# EAGLE design GolGrid (EAGLE 5.11)
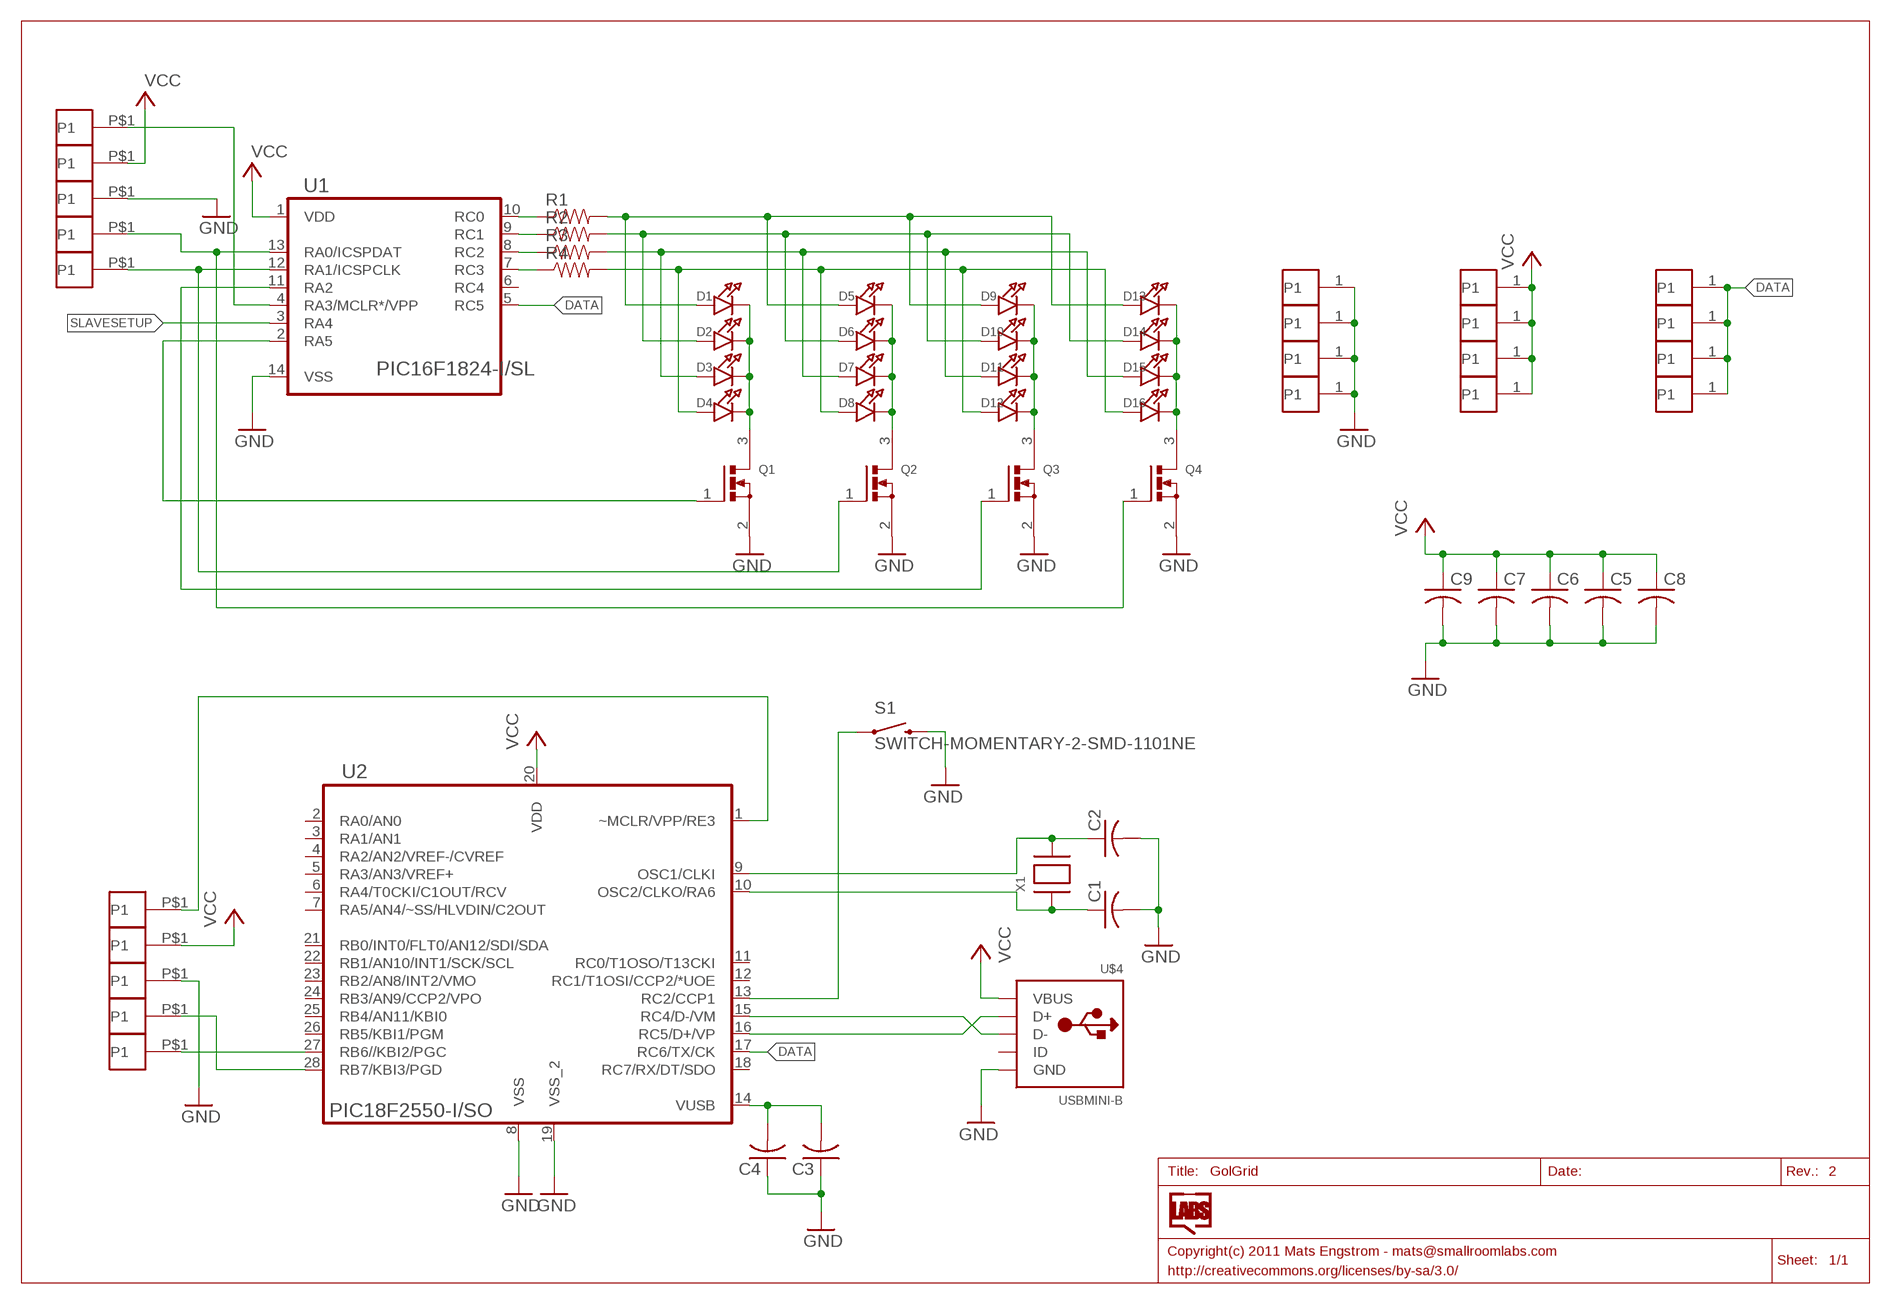
[diagram p0: schematic, sheet 1]

## Parts
C1  C-USC0805  [C0805]
C2  C-USC0805  [C0805]
C3  C-USC0805  [C0805]
C4  C-USC0805  [C0805]
C5  C-USC1206  [C1206]
C6  C-USC0805  [C0805]
C7  C-USC0805  [C0805]
C8  C-USC1206  [C1206]
C9  C-USC1206  [C1206]
D1  LEDSMD0805  [CHIPLED_0805]
D2  LEDSMD0805  [CHIPLED_0805]
D3  LEDSMD0805  [CHIPLED_0805]
D4  LEDSMD0805  [CHIPLED_0805]
D5  LEDSMD0805  [CHIPLED_0805]
D6  LEDSMD0805  [CHIPLED_0805]
D7  LEDSMD0805  [CHIPLED_0805]
D8  LEDSMD0805  [CHIPLED_0805]
D9  LEDSMD0805  [CHIPLED_0805]
D10  LEDSMD0805  [CHIPLED_0805]
D11  LEDSMD0805  [CHIPLED_0805]
D12  LEDSMD0805  [CHIPLED_0805]
D13  LEDSMD0805  [CHIPLED_0805]
D14  LEDSMD0805  [CHIPLED_0805]
D15  LEDSMD0805  [CHIPLED_0805]
D16  LEDSMD0805  [CHIPLED_0805]
P1  PAD06S1  [PAD06STOP1]
P2  PAD06S1  [PAD06STOP1]
P3  PAD06S1  [PAD06STOP1]
P4  PAD06S1  [PAD06STOP1]
P5  PAD06S1  [PAD06STOP1]
P6  PAD06S1  [PAD06STOP1]
P7  PAD06S1  [PAD06STOP1]
P8  PAD06S1  [PAD06STOP1]
P9  PAD06S1  [PAD06STOP1]
P10  PAD06S1  [PAD06STOP1]
P11  PAD06S1  [PAD06STOP1]
P12  PAD06S1  [PAD06STOP1]
PGND1  PADPAD1.5X2.5  [PAD1.5X2.5]
PGND2  PADPAD1.5X2.5  [PAD1.5X2.5]
PPGC1  PADPAD1.5X2.5  [PAD1.5X2.5]
PPGC2  PADPAD1.5X2.5  [PAD1.5X2.5]
PPGD1  PADPAD1.5X2.5  [PAD1.5X2.5]
PPGD2  PADPAD1.5X2.5  [PAD1.5X2.5]
PVCC1  PADPAD1.5X2.5  [PAD1.5X2.5]
PVCC2  PADPAD1.5X2.5  [PAD1.5X2.5]
PVPP1  PADPAD1.5X2.5  [PAD1.5X2.5]
PVPP2  PADPAD1.5X2.5  [PAD1.5X2.5]
Q1  MOSFET-NWAVE  [SOT23-W]
Q2  MOSFET-NWAVE  [SOT23-W]
Q3  MOSFET-NWAVE  [SOT23-W]
Q4  MOSFET-NWAVE  [SOT23-W]
R1  RESISTOR0805-RES  [0805]
R2  RESISTOR0805-RES  [0805]
R3  RESISTOR0805-RES  [0805]
R4  RESISTOR0805-RES  [0805]
S1  SWITCH-MOMENTARY-2-SMD-1101NE  [TACTILE-SWITCH-1101NE]
U1  PIC16F1824-I/SL  [SOIC127P600X175-14N]
U2  PIC18F2550-I/SO  [SOIC127P1034X264-28N]
U$4  USBMINI-B  [MOLEX67503]
X1  XTALNX5032  [NX5032]

## Nets
ANODE1: D1.A D5.A D9.A D13.A R1.2
ANODE2: D2.A D6.A D10.A D14.A R2.2
ANODE3: D3.A D7.A D11.A D15.A R3.2
ANODE4: D4.A D8.A D12.A D16.A R4.2
CATH0: PPGD1.P$1(P1) Q4.1(G) U1.13(RA0/ICSPDAT)
CATH1: PPGC1.P$1(P1) Q2.1(G) U1.12(RA1/ICSPCLK)
CATH2: Q3.1(G) U1.11(RA2)
CATH3: Q1.1(G) U1.2(RA5)
CATHODE1: D1.C D2.C D3.C D4.C Q1.3(D)
CATHODE2: D5.C D6.C D7.C D8.C Q2.3(D)
CATHODE3: D9.C D10.C D11.C D12.C Q3.3(D)
CATHODE4: D13.C D14.C D15.C D16.C Q4.3(D)
DATA: P9.1 P10.1 P11.1 P12.1 U1.5(RC5) U2.17(RC6/TX/CK)
GND: C1.2 C2.2 C3.1 C4.1 C5.2 C6.2 C7.2 C8.2 C9.2 P1.1 P2.1 P3.1 P4.1 PGND1.P$1(P1) PGND2.P$1(P1) Q1.2(S) Q2.2(S) Q3.2(S) Q4.2(S) S1.P$2 U1.14(VSS) U2.8(VSS) U2.19(VSS_2) U$4.GND
N$1: R1.1 U1.10(RC0)
N$2: C3.2 C4.2 U2.14(VUSB)
N$3: R2.1 U1.9(RC1)
N$4: R3.1 U1.8(RC2)
N$5: R4.1 U1.7(RC3)
N$6: C1.1 U2.10(OSC2/CLKO/RA6) X1.P$1
N$7: C2.1 U2.9(OSC1/CLKI) X1.P$2
N$8: U2.16(RC5/D+/VP) U$4.D+
N$9: U2.15(RC4/D-/VM) U$4.D-
N$10: PPGD2.P$1(P1) U2.28(RB7/KBI3/PGD)
N$11: PPGC2.P$1(P1) U2.27(RB6//KBI2/PGC)
N$12: PVPP2.P$1(P1) U2.1(~MCLR/VPP/RE3)
N$14: S1.P$1 U2.13(RC2/CCP1)
N$15: PVPP1.P$1(P1) U1.4(RA3/MCLR*/VPP)
SLAVESETUP: U1.3(RA4)
VCC: C5.1 C6.1 C7.1 C8.1 C9.1 P5.1 P6.1 P7.1 P8.1 PVCC1.P$1(P1) PVCC2.P$1(P1) U1.1(VDD) U2.20(VDD) U$4.VBUS
Unconnected: U1.6(RC4) U2.2(RA0/AN0) U2.3(RA1/AN1) U2.4(RA2/AN2/VREF-/CVREF) U2.5(RA3/AN3/VREF+) U2.6(RA4/T0CKI/C1OUT/RCV) U2.7(RA5/AN4/~SS/HLVDIN/C2OUT) U2.11(RC0/T1OSO/T13CKI) U2.12(RC1/T1OSI/CCP2/*UOE) U2.18(RC7/RX/DT/SDO) U2.21(RB0/INT0/FLT0/AN12/SDI/SDA) U2.22(RB1/AN10/INT1/SCK/SCL) U2.23(RB2/AN8/INT2/VMO) U2.24(RB3/AN9/CCP2/VPO) U2.25(RB4/AN11/KBI0) U2.26(RB5/KBI1/PGM) U$4.ID

## Library data of the parts
C1-C9 = rcl:C-US: CAPACITOR, American symbol
D1-D16 = SmallRoomLabs:LED
P1-P12 PGND1 PGND2 PPGC1 PPGC2 PPGD1 PPGD2 PVCC1 PVCC2 PVPP1 PVPP2 = SmallRoomLabs:PAD
Q1-Q4 = microbuilder:MOSFET-N: N-Channel Mosfet Digikey: 2N7002ET1GOSTR-ND
R1-R4 = SparkFun:RESISTOR: Resistor Basic schematic elements and footprints for 0603, 1206, and PTH resistors.
S1 = SparkFun:SWITCH-MOMENTARY-2
U1 = SmallRoomLabs:PIC16F1824-I/SL: 14/20-Pin Flash Microcontrollers with XLP Technology,SOIC-14; MPN: PIC16F1824-I/SL; OC_FARNELL: 1814945; OC_NEWARK: 65R5965; PACKAGE: SOIC-14; SUPPLIER: Microchip
U2 = SmallRoomLabs:PIC18F2550-I/SO: High-Performance Enhanced Flash Microcontrollers; MPN: PIC18F2550-I/SO; OC_FARNELL: 9321268; OC_NEWARK: 73K1297; PACKAGE: SOIC-28; SUPPLIER: Microchip
U$4 = SmallRoomLabs:USB
X1 = adafruit:XTAL: Low cost SMT crystals, no capacitors included http://www.ladyada.net/library/eagle

## Board
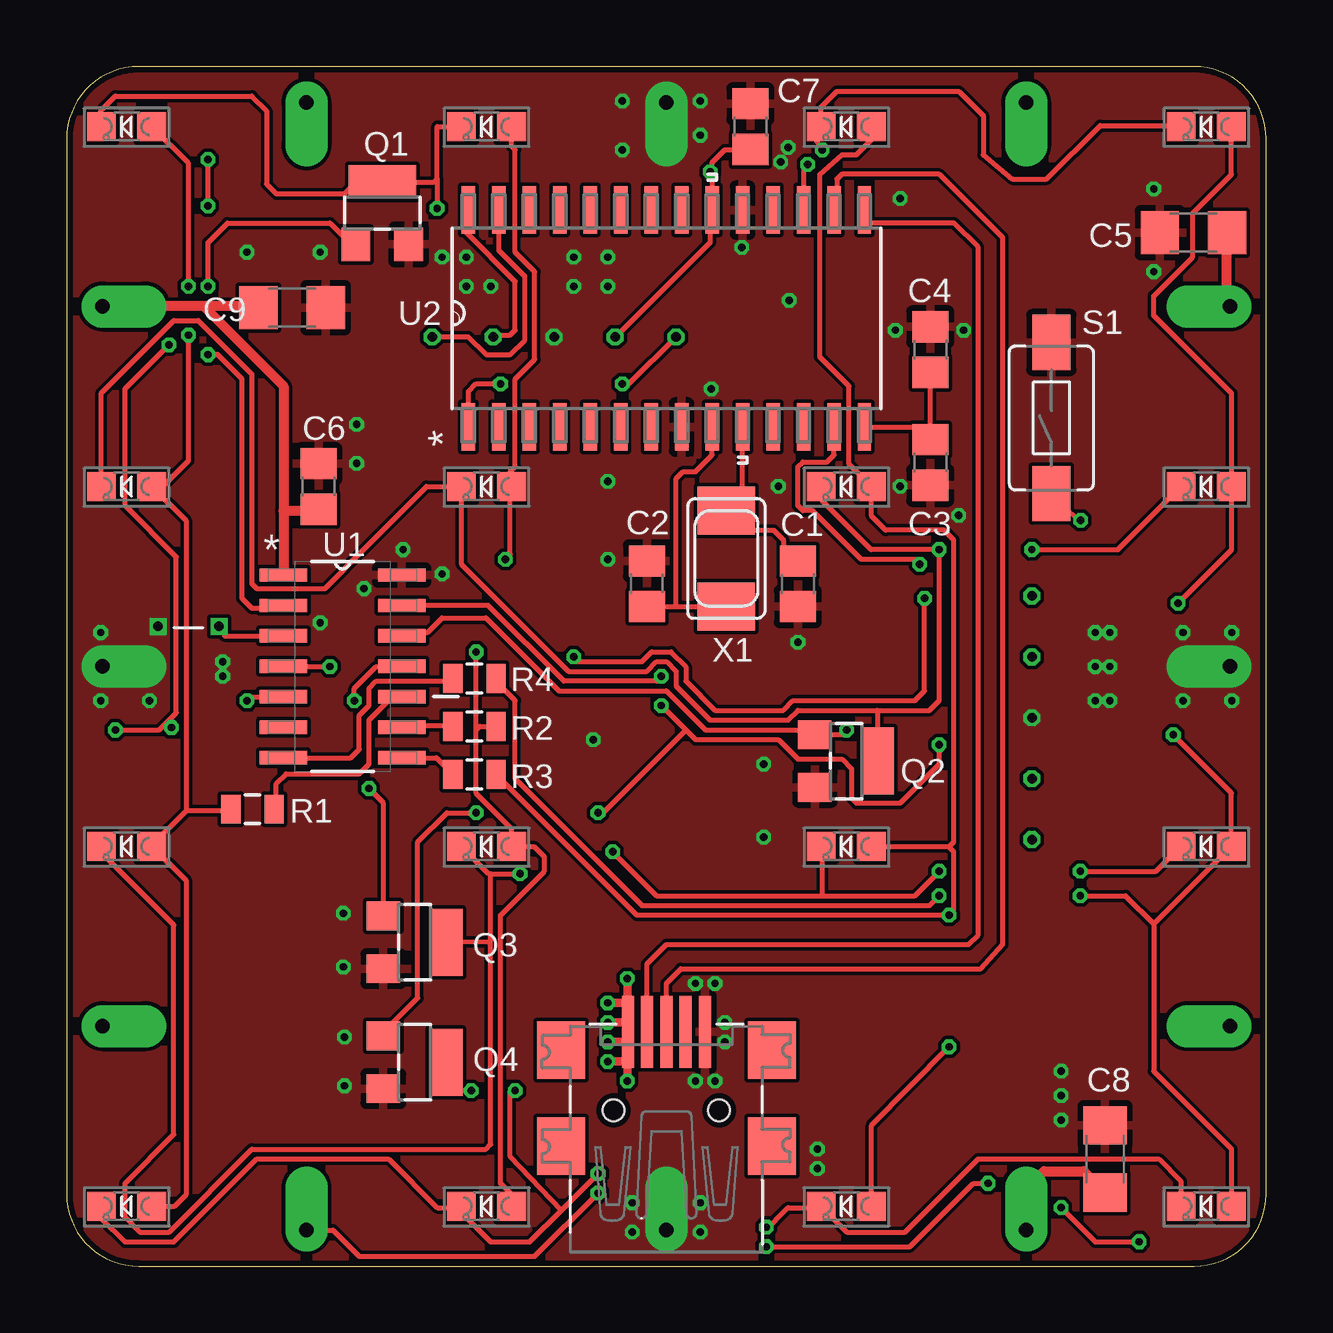
[diagram p1: board, top side]
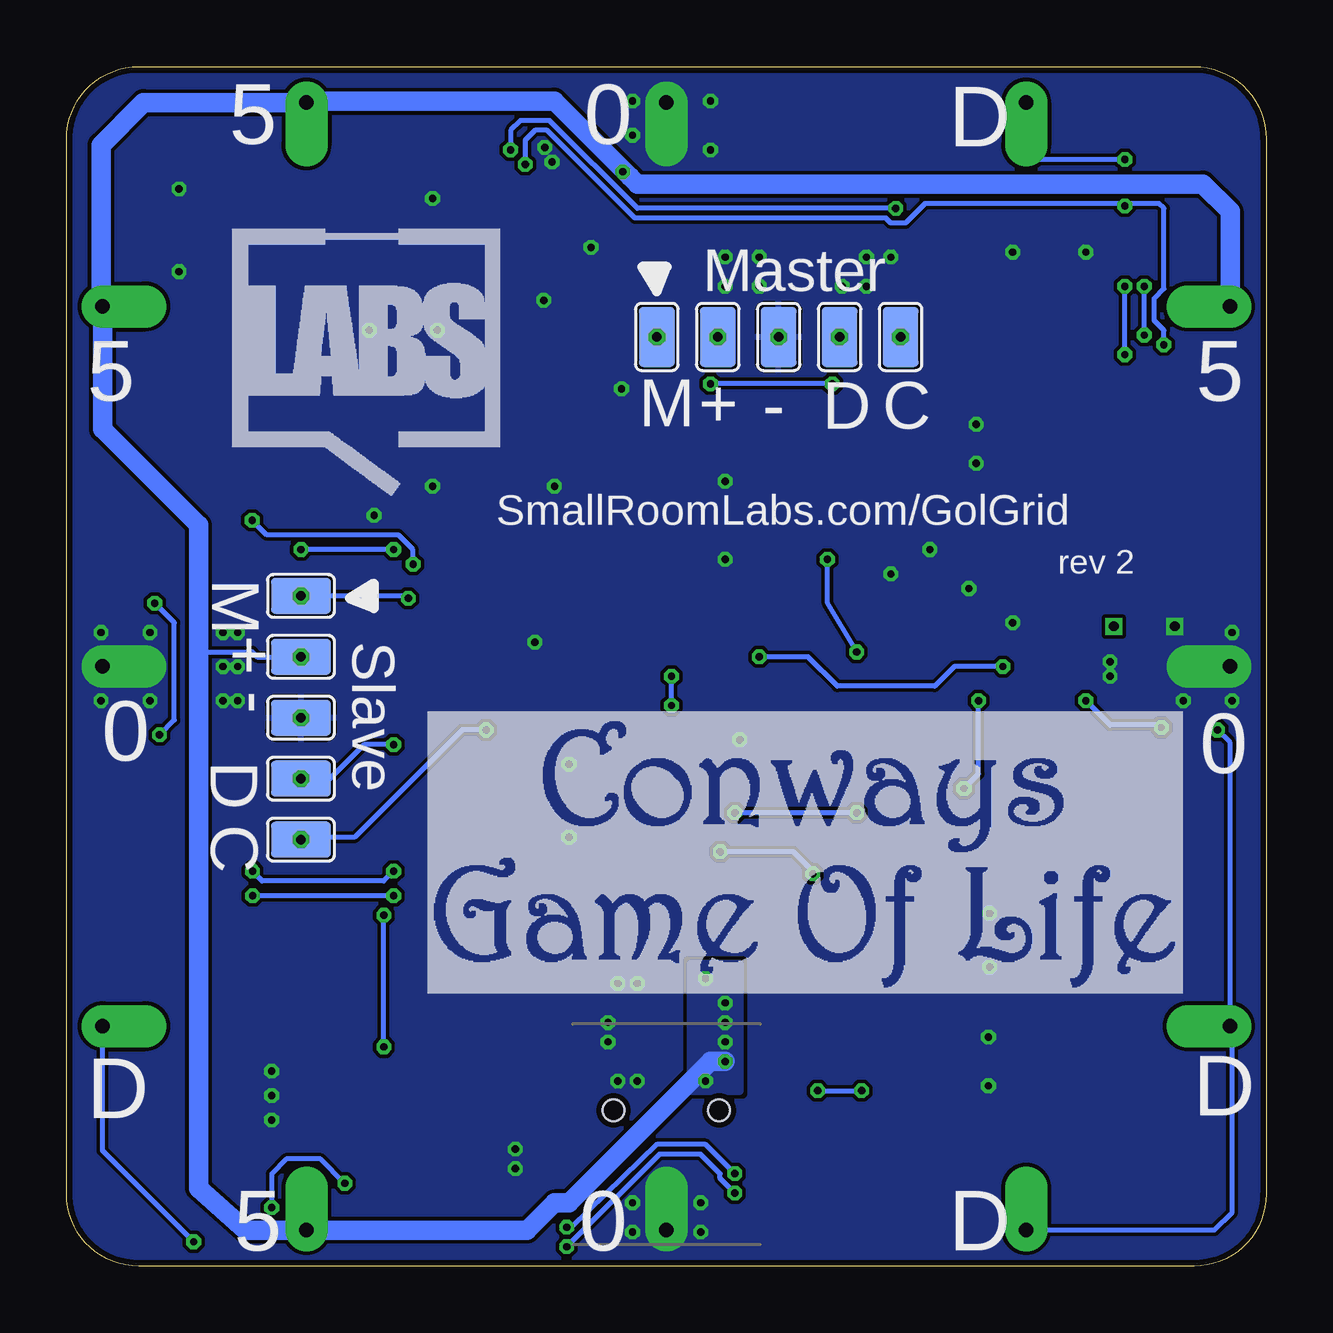
[diagram p2: board, bottom side, seen from below]

Size 50 x 50 mm. Coordinates in mm from the lower left corner, seen from the top.
Outline: 3,50 arc90 0,47 0,3 arc90 3,0 47,0 arc90 50,3 50,47 arc90 47,50 3,50
Copper layers (1*16): Top 0.035mm / dielectric 1.5mm / Bottom 0.035mm
Design rules "Fusion_eagle_rule_v1.1": minimum track width 6mil, minimum drill 12mil, track to track 6mil, track to pad 6mil, pad to pad 6mil, via to via 6mil, smd to smd 0mil, copper to edge 10mil, drill to drill 10mil, minimum pad ring 10mil, minimum via ring 6mil, stop-mask expansion 2mil, vias tented up to drill 100mil, thermal gap 10mil

### Footprints (pad centres in the part's own frame; a part is rotated, then mirrored left to right if it is on the bottom)
C0805 = smd 1.3 x 1.5: 1 -0.95,0; 2 0.95,0
C1206 = smd 1.6 x 1.8: 1 -1.4,0; 2 1.4,0
CHIPLED_0805 = smd 1.2 x 1.2: A 0,-1.05; C 0,1.05
PAD06STOP1 = drill 0.6 pad 1.778 offset: 1 0,0
PAD1.5X2.5 = smd 1.5 x 2.5: P$1 0,0
SOT23-W = smd 1.2 x 1.4: 1 -1.1,-1.3; 2 1.1,-1.3 | smd 2.8 x 1.4: 3 0,1.3
0805 = smd 0.8 x 1.2: 1 -0.9,0; 2 0.9,0
TACTILE-SWITCH-1101NE = smd 2.3 x 1.6: P$1 -3.15,0; P$2 3.15,0
SOIC127P600X175-14N = smd 1.981 x 0.559: 1 -2.464,3.81; 2 -2.464,2.54; 3 -2.464,1.27; 4 -2.464,0; 5 -2.464,-1.27; 6 -2.464,-2.54; 7 -2.464,-3.81; 8 2.464,-3.81; 9 2.464,-2.54; 10 2.464,-1.27; 11 2.464,0; 12 2.464,1.27; 13 2.464,2.54; 14 2.464,3.81
SOIC127P1034X264-28N = smd 1.981 x 0.559: 1 -4.521,8.255; 2 -4.521,6.985; 3 -4.521,5.715; 4 -4.521,4.445; 5 -4.521,3.175; 6 -4.521,1.905; 7 -4.521,0.635; 8 -4.521,-0.635; 9 -4.521,-1.905; 10 -4.521,-3.175; 11 -4.521,-4.445; 12 -4.521,-5.715; 13 -4.521,-6.985; 14 -4.521,-8.255; 15 4.521,-8.255; 16 4.521,-6.985; 17 4.521,-5.715; 18 4.521,-4.445; 19 4.521,-3.175; 20 4.521,-1.905; 21 4.521,-0.635; 22 4.521,0.635; 23 4.521,1.905; 24 4.521,3.175; 25 4.521,4.445; 26 4.521,5.715; 27 4.521,6.985; 28 4.521,8.255
MOLEX67503 = smd 0.5 x 3: D+ 0,3.264; D- -0.8,3.264; GND 1.6,3.264; ID 0.8,3.264; VBUS -1.6,3.264 | smd 2 x 2.4: GND1 -4.4,-1.5; GND2 -4.4,2.5; GND3 4.4,2.5; GND4 4.4,-1.5 | hole 0.9: -2.2,0; 2.2,0
NX5032 = smd 2 x 2.4: P$1 2,0; P$2 -2,0

### Placement (x,y rotation side)
C1  30.48,28.45 270 top
C2  24.18,28.45 90 top
C3  36,33.5 90 top
C4  36,38.2 270 top
C5  46.96,43.08 180 top
C6  10.5,32.5 90 top
C7  28.5,47.5 90 top
C8  43.28,4.47 90 top
C9  9.4,39.95 0 top
D1  2.5,47.5 90 top
D2  17.5,47.5 90 top
D3  32.5,47.5 90 top
D4  47.5,47.5 90 top
D5  2.5,32.5 90 top
D6  17.5,32.5 90 top
D7  32.5,32.5 90 top
D8  47.5,32.5 90 top
D9  2.5,17.5 90 top
D10  17.5,17.5 90 top
D11  32.5,17.5 90 top
D12  47.5,17.5 90 top
D13  2.5,2.5 90 top
D14  17.5,2.5 90 top
D15  32.5,2.5 90 top
D16  47.5,2.5 90 top
P1  1.5,25 0 top
P2  25,1.5 90 top
P3  48.5,25 180 top
P4  25,48.5 270 top
P5  1.5,40 0 top
P6  48.5,40 180 top
P7  40,48.5 270 top
P8  40,1.5 90 top
P9  10,1.5 90 top
P10  1.5,10 0 top
P11  48.5,10 180 top
P12  10,48.5 270 top
PGND1  40.23,22.86 270 bottom
PGND2  20.32,38.73 180 bottom
PPGC1  40.23,17.78 270 bottom
PPGC2  15.24,38.73 180 bottom
PPGD1  40.23,20.32 270 bottom
PPGD2  17.78,38.73 180 bottom
PVCC1  40.23,25.4 270 bottom
PVCC2  22.86,38.73 180 bottom
PVPP1  40.23,27.94 270 bottom
PVPP2  25.4,38.73 180 bottom
Q1  13.16,43.89 0 top
Q2  32.49,21.06 270 top
Q3  14.5,13.5 270 top
Q4  14.5,8.5 270 top
R1  7.75,19.05 180 top
R2  17,22.5 0 top
R3  17,20.5 0 top
R4  17,24.5 0 top
S1  41.05,35.36 90 top
U1  11.5,25 0 top
U2  25,39.5 90 top
U$4  25,6.5 0 top
U$6  [SRL-LOGO-SILK-10MM]  43.08,32.11 0 bottom
X1  27.5,29.5 90 top

### Tracks (layer width: path | path; a pad name or v marks a point on that pad's centre or on a via)
ANODE1  (via drill 0.3)
  Top 0.203: D13.A 4.5,2.5 5,3 5,16.05 D9.A 3.55,17.55 5,19 | 5,19 5,31.05 D5.A 4,32.5 5.08,33.58 v5.08,38.81 | v5.08,40.84 5.08,45.97 D1.A | 5,19 6.8,19 R1.2
  Bottom 0.203: v5.08,38.81 v5.08,40.84
ANODE2  (via drill 0.3)
  Top 0.203: D2.A 18.55,46.68 18.69,46.53 18.69,42.27 19.51,41.45 19.51,37.8 18.69,36.98 18.69,33.33 18.49,33.12 18.49,32.56 D6.A 18.49,32.44 18.49,29.67 v18.29,29.46 | D10.A 18.55,18.23 17.07,19.71 17.07,22.35 | 17.07,22.35 v17.07,25.6 | R2.2 17.22,22.5 17.07,22.35 | D14.A 18.55,2.99 18.09,3.45 18.09,14.63 19.91,16.46 19.91,17.07 19.51,17.48 18.57,17.48 D10.A | D10.A 18.49,17.44
  Bottom 0.203: v17.07,25.6 18.29,27.64 v18.29,29.46
ANODE3  (via drill 0.3)
  Top 0.203: D15.A 33.55,5.87 v36.78,9.14 | 33.53,17.48 D11.A 33.58,17.48 36.78,17.48 | D3.A 33.55,46.96 32.92,46.33 32.31,46.33 31.39,45.52 31.39,37.9 32.61,36.68 32.61,33.44 D7.A 33.55,31.27 34.14,30.68 36.58,30.68 36.98,30.28 36.98,17.68 36.78,17.48 | R3.2 23.77,14.63 v36.78,14.63 36.98,14.83 36.98,17.27 36.78,17.48
  Bottom 0.203: v36.78,9.14 v36.78,14.63
ANODE4  (via drill 0.3)
  Top 0.203: D16.A 48.55,4.89 45.31,8.13 45.31,14.26 | D12.A 48.56,17.48 | v46.33,27.64 48.56,29.87 48.56,32.48 D8.A 48.56,32.52 48.56,36.37 45.31,39.62 45.31,40.44 46.94,42.06 46.94,43.89 48.55,45.5 D4.A | D12.A 48.55,19.73 v46.13,22.15 | R4.2 17.9,24.37 18.69,23.57 18.69,20.32 23.98,15.04 35.97,15.04 v36.37,15.44 | 45.31,14.26 D12.A | v42.25,15.44 44.13,15.44 45.31,14.26
  Bottom 0.203: v46.33,27.64 45.52,26.82 45.52,22.76 v46.13,22.15 | v36.37,15.44 v42.25,15.44
CATH0  (via drill 0.3, 0.4)
  Top 0.203: v24.79,24.59 24.59,24.38 20.73,24.38 17.57,27.54 U1.13 | v36.37,21.74 36.37,20.93 34.75,19.3 32.92,19.3 32.72,19.51 32.72,20.73 32.31,21.13 30.48,21.13 29.67,21.95 26.21,21.95 25.81,22.35 | 25.81,22.35 v24.79,23.37 | v17.07,18.9 15.85,18.9 14.63,17.68 14.63,11.18 13.2,9.75 Q4.1 | v22.15,18.9 22.35,18.9 25.81,22.35
  Bottom 0.203: v24.79,23.37 v24.79,24.59 | v36.37,21.74 37.59,21.74 39.01,20.32 PPGD1.P$1 | v17.07,18.9 v22.15,18.9
  other vias: 40.23,20.32
CATH1  (via drill 0.3, 0.4)
  Top 0.203: v32.51,22.35 32.32,22.16 Q2.1 30.99,22.35 26.62,22.35 24.99,23.98 20.52,23.98 17.48,27.03 15.65,27.03 15.04,26.42 14.11,26.42 U1.12
  Bottom 0.203: v32.51,22.35 33.53,22.35 38,17.88 40.13,17.88 PPGC1.P$1
  other vias: 40.23,17.78
CATH2  (via drill 0.3)
  Top 0.203: v11.99,23.57 11.99,24.08 12.9,24.99 U1.11 | Q3.1 13.21,19.3 v12.6,19.91
  Bottom 0.203: v11.99,23.57 11.99,20.52 v12.6,19.91
CATH3  (via drill 0.3)
  Top 0.203: v5.89,40.84 5.89,42.67 6.71,43.48 10.97,43.48 11.87,42.59 Q1.1 | v5.89,38 6.3,38 7.32,36.98 7.32,27.84 7.72,27.43 8.93,27.43 U1.2
  Bottom 0.203: v5.89,38 v5.89,40.84
CATHODE1  (via drill 0.3)
  Top 0.203: D3.C 31.45,48.32 32.11,48.97 37.19,48.97 38.2,47.95 38.2,46.33 39.42,45.31 40.84,45.31 43.08,47.55 46.4,47.55 D4.C | D2.C 15.44,47.5 15.44,45.31 | 15.44,45.31 v15.44,44.09 | D3.C 31.2,47.75 | v31.5,46.53 31.09,47.14 D3.C | 15.44,45.31 15.32,45.19 Q1.3 13.04,45.31 12.19,45.31 11.58,44.7 8.74,44.7 8.33,45.11 8.33,48.16 7.72,48.77 2.03,48.77 1.42,48.16 1.42,47.53 D1.C
  Bottom 0.203: v15.44,44.09 26.21,44.09 29.87,47.75 31.09,47.75 31.5,47.35 v31.5,46.53
CATHODE2  (via drill 0.3)
  Top 0.203: D5.C 1.45,36.4 4.47,39.42 5.49,39.42 7.72,37.19 7.72,28.45 7.92,28.25 10.77,28.25 11.58,29.06 11.58,29.08 15,32.5 D6.C 16.45,29.27 20.93,24.79 24.18,24.79 24.59,25.2 24.99,25.2 25.4,24.79 25.4,24.18 26.82,22.76 30.07,22.76 30.48,23.16 33.79,23.16 | D7.C 31.5,32.45 31.5,31.9 33.53,29.87 v36.37,29.87 36.37,23.57 35.97,23.16 33.79,23.16 | 33.93,21.2 Q2.3 33.79,23.16 | v40.23,29.87 43.82,29.87 D8.C
  Bottom 0.203: v36.37,29.87 v40.23,29.87
CATHODE3  (via drill 0.3)
  Top 0.203: D9.C 1.45,17.24 4.47,14.22 4.47,5.49 2.44,3.45 2.44,2.03 3.05,1.42 4.27,1.42 7.72,4.88 17.48,4.88 17.68,5.08 17.68,13.61 | 16.27,17.68 D10.C 17.59,16.36 17.68,16.36 | v22.76,17.27 24.59,15.44 31.5,15.44 | D11.C 31.5,17.45 31.5,15.44 | v42.25,16.46 45.41,16.46 D12.C | 31.5,15.44 35.36,15.44 v36.37,16.46 | 17.68,16.36 v18.9,16.36 | Q3.3 17.58,13.51 17.68,13.61 | 17.68,13.61 17.68,16.36
  Bottom 0.203: v18.9,16.36 18.9,16.46 19.71,17.27 v22.76,17.27 | v36.37,16.46 36.78,16.05 41.86,16.05 v42.25,16.46
CATHODE4  (via drill 0.3)
  Top 0.203: D13.C 1.45,2 2.44,1.02 4.47,1.02 7.92,4.47 13.41,4.47 15.44,2.44 16.39,2.44 D14.C 16.45,2.24 17.68,1.02 19.3,1.02 20.62,2.34 | 20.62,2.34 v22.15,3.86 | v29.16,1.63 29.06,1.42 30.07,2.44 31.39,2.44 D15.C 32.53,1.42 34.95,1.42 38,4.47 45.52,4.47 46.45,3.54 D16.C | 20.62,2.34 18.49,4.57 18.49,7.32 v18.69,7.32 | v16.87,7.32 15.8,7.32 Q4.3
  Bottom 0.203: v29.16,1.63 28.96,1.63 25.4,5.08 23.37,5.08 v22.15,3.86 | v18.69,7.32 v16.87,7.32
DATA  (via drill 0.3)
  Top 0.203: U2.17 30.71,45.69 v30.89,45.92 | v2.03,22.35 3.86,22.35 4.17,22.66 | 4.17,22.66 4.57,23.06 4.57,29.57 2.44,31.7 2.44,36.58 v4.27,38.41 | v5.89,44.2 v5.89,46.13 | U1.5 7.68,23.73 v7.52,23.57 | 4.17,22.66 v4.37,22.45 | P9.1 11.1,1.5 12.19,0.41 19.51,0.41 v22.15,3.05 | v29.16,0.81 35.15,0.81 37.8,3.45 v38.41,3.45 | v41.45,2.44 42.88,1.02 v44.7,1.02
  Bottom 0.203: P9.1 2.16,1.5 1.42,2.23 1.42,9.92 P10.1 1.5,21.82 v2.03,22.35 | v30.89,45.92 30.89,46.94 30.48,47.35 29.97,47.35 26.31,43.69 15.85,43.69 15.65,43.48 15.04,43.48 14.22,44.3 5.89,44.3 | v5.89,46.13 9.75,46.13 9.96,46.33 9.96,48.46 P12.1 | 5.89,44.3 4.47,44.3 4.27,44.09 4.27,40.74 4.67,40.34 4.67,39.42 4.27,39.01 v4.27,38.41 | 5.89,44.09 v5.89,44.2 5.89,44.3 | v7.52,23.57 6.5,22.55 4.47,22.55 v4.37,22.45 | v29.16,0.81 25.3,4.67 23.57,4.67 22.76,3.86 22.76,3.66 v22.15,3.05 | v38.41,3.45 39.42,4.47 40.84,4.47 41.45,3.86 v41.45,2.44 | v44.7,1.02 48.5,4.81 P11.1
GND  (via drill 0.3, 0.4)
  other vias: 28.14,42.47 26.87,36.58 21.13,42.06 23.16,48.56 23.16,46.53 22.56,42.06 30.07,46.63 29.77,46.02 48.56,26.42 46.53,26.42 43.48,26.42 43.48,23.57 43.48,24.99 48.56,23.57 46.53,23.57 42.88,26.42 42.88,24.99 42.88,23.57 27.03,7.72 26.21,7.72 26.21,11.79 27.03,11.79 27.43,10.16 27.43,9.35 23.57,2.64 23.57,1.42 26.42,1.42 26.42,2.64 31.29,4.06 31.29,4.88 1.42,23.57 1.42,26.42 3.45,23.57 34.75,44.5 34.54,39.01 34.75,32.51 22.56,32.72 15.65,42.06 16.66,42.06 16.66,40.84 17.68,40.84 21.13,40.84 22.56,40.84 6.5,25.2 7.52,42.27 10.57,42.27 12.4,28.24 15.65,28.85 26.42,48.56 26.42,47.14 12.08,35.09 12.08,33.46 11.53,14.71 11.53,12.47 41.45,8.13 41.45,6.1 41.45,7.11 45.31,44.91 45.31,41.45 11.58,7.52 30.12,40.26 29.06,20.93 30.48,26.01 22.56,29.46 11.58,9.55 29.06,17.88 6.5,24.59 10.57,26.82 21.95,21.95 14.02,29.87 37.19,31.29 37.39,39.01 20.32,38.73 40.23,22.86 29.67,32.51 3.81,26.67
  pour Bottom (rank 5): 0,25 0,47 arc-90 3,50 25,50 47,50 arc-90 50,47 50,25 50,3 arc-90 47,0 25,0 3,0 arc-90 0,3
  pour Top: 0,25 0,47 arc-90 3,50 25,50 47,50 arc-90 50,47 50,3 arc-90 47,0 25,0 3,0 arc-90 0,3
N$1
  Top 0.203: 13.92,23.77 U1.10 13.8,23.57 13.41,23.57 12.6,22.76 12.6,20.93 12.19,20.52 9.14,20.52 8.74,20.12 8.74,19.14 R1.1
N$2
  Top 0.203: U2.14 35.47,34.98 C3.2 C4.2
N$3
  Top 0.203: U1.9 14.03,22.53 16.07,22.53 R2.1
N$4
  Top 0.203: U1.8 15.41,21.19 R3.1
N$5
  Top 0.203: R4.1 15.97,24.5 15.85,24.38 12.9,24.38 12.6,24.08 12.6,23.37 12.19,22.96 12.19,21.54 11.84,21.19 U1.7
N$6
  Top 0.203: 28.18,32.17 U2.10 | X1.P$1 28.18,32.17 | 28.18,32.17 28.18,30.96 28.45,30.68 29.46,30.68 29.87,30.28 29.87,29.98 C1.1
N$7
  Top 0.203: 25.4,27.5 24.5,27.5 C2.1 | 25.4,27.5 X1.P$2 | 25.4,27.5 25.4,32.83 25.7,33.12 26.21,33.12 26.91,33.81 U2.9
N$8
  Top 0.203: U$4.D+ 24.99,11.79 25.6,12.39 38.11,12.39 39.01,13.41 39.01,42.88 36.37,45.52 32.31,45.52 32.11,45.31 32.11,44.14 U2.16
N$9
  Top 0.203: U$4.D- 24.18,9.78 24.18,12.6 24.99,13.41 37.59,13.41 38,13.82 38,42.47 36.98,43.48 33.38,43.48 U2.15
N$10  (via drill 0.4)
  Top 0.203: U2.28 16.66,43.94 16.66,43.08 18.69,41.05 18.69,39.01 18.49,38.81 17.86,38.81 PPGD2.P$1
  other vias: 17.78,38.73
N$11  (via drill 0.4)
  Top 0.203: U2.27 18.02,42.34 19.1,41.25 19.1,38.61 18.49,38 17.48,38 16.74,38.73 PPGC2.P$1
  other vias: 15.24,38.73
N$12  (via drill 0.3, 0.4)
  Top 0.203: U2.1 16.75,36.45 17.07,36.78 v18.09,36.78 | v23.16,36.78 23.47,36.8 PVPP2.P$1
  Bottom 0.203: v18.09,36.78 v23.16,36.78
  other vias: 25.4,38.73
N$14  (via drill 0.3)
  Top 0.203: U2.13 31.98,33.81 31.7,33.53 30.68,33.53 30.48,33.33 30.48,31.7 30.68,31.5 31.09,31.5 33.12,29.46 35.36,29.46 v35.56,29.26 | v42.27,31.09 41.25,31.8 S1.P$1
  Bottom 0.203: v35.56,29.26 35.56,29.87 36.17,30.48 41.66,30.48 v42.27,31.09
N$15  (via drill 0.3, 0.4)
  Top 0.203: v35.76,27.84 35.76,23.98 35.36,23.57 30.28,23.57 29.87,23.16 27.03,23.16 25.81,24.38 25.81,24.99 25.2,25.6 24.38,25.6 23.98,25.2 21.34,25.2 v21.13,25.4 | v10.97,24.99 U1.4
  Bottom 0.203: PVPP1.P$1 35.87,27.94 v35.76,27.84 | v21.13,25.4 19.1,25.4 17.88,24.18 13.82,24.18 13.01,24.99 v10.97,24.99
  other vias: 40.23,27.94
SLAVESETUP  (via drill 0.4)
  Top 0.203: 8.33,26.21 8.39,26.27 U1.3 6.58,26.27 v6.35,26.67
VCC  (via drill 0.3, 0.4)
  Top 0.203: C7.1 28.48,46.53 27.43,46.53 26.91,46.01 26.91,45.7 v26.82,45.62 26.91,45.54 U2.20 26.82,43.94 26.82,42.67 22.89,38.73 PVCC2.P$1
  Top 0.356: 23.37,10.97 23.37,9.8 U$4.VBUS | 23.37,10.97 v23.37,11.99 | 23.37,10.97 v22.55,10.97 | v22.55,10.16 23.4,10.16 U$4.VBUS | v22.55,9.35 23.4,9.35 U$4.VBUS | v22.55,8.53 23.37,8.53 | 23.37,8.53 23.4,8.53 U$4.VBUS | 23.37,8.53 v23.37,7.72
  Top 0.406: 5.69,40.03 1.53,40.03 P5.1 | 5.69,40.03 9.04,36.68 9.04,31.5 | 9.04,31.5 U1.1 | C6.1 10.4,31.5 9.04,31.5 | 5.69,40.03 8.17,40.03 C9.1 | C5.1 48.37,40.13 P6.1 | C8.1 42.39,3.96 40.74,3.96 40,3.22 P8.1
  Bottom 0.203: PVCC1.P$1 42.06,25.4 42.27,25.6 44.3,25.6 44.5,25.81
  Bottom 0.406: v26.82,45.62 26.52,45.62 26.52,45.41
  Bottom 0.813: P5.1 1.5,43.97 2.64,45.11 26.21,45.11 26.52,45.41 29.67,48.56 39.94,48.56 P7.1 46.8,48.5 48.56,46.74 48.56,40.06 P6.1 48.5,34.89 44.5,30.89 44.5,25.81 44.5,3.25 42.55,1.5 P8.1 30.81,1.5 29.67,2.64 29.06,2.64 23.16,8.53 v22.55,8.53
  other vias: 22.86,38.73 40.23,25.4
  pour Bottom: 21.95,12.6 23.98,12.6 23.98,7.32 21.95,7.32 21.95,12.4

### Text on the board
bPlace: D | 0 | 5 | Master | 5 | 5 | C | D | - | + | M | SmallRoomLabs.com/GolGrid | rev 2 | M | Slave | + | - | 0 | D | 0 | C | D | D | D | 0 | 5